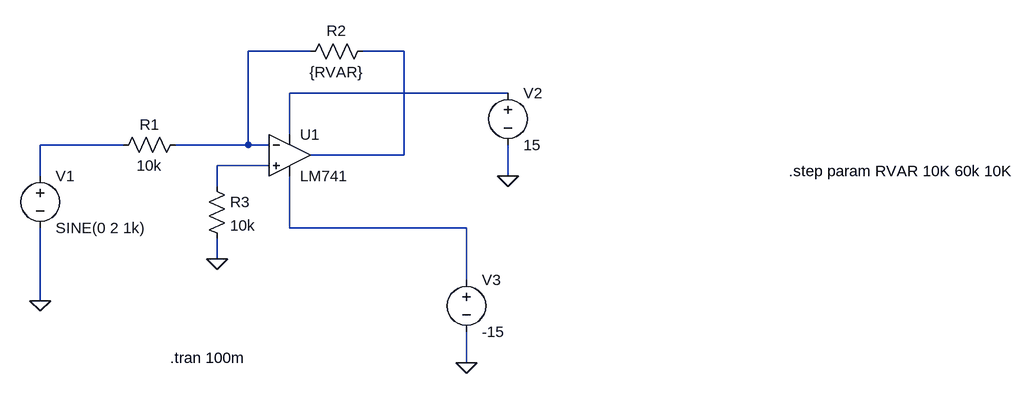
[diagram p0: schematic eviren_kuvvetlendirici_pot_lm741.asc]
eviren_kuvvetlendirici_pot_lm741.asc, the LTspice schematic file:
Version 4
SHEET 1 1424 680
WIRE 288 16 192 16
WIRE 432 16 368 16
WIRE 592 80 256 80
WIRE 256 144 256 80
WIRE 0 160 -128 160
WIRE 192 160 192 16
WIRE 192 160 80 160
WIRE 224 160 192 160
WIRE 432 176 432 16
WIRE 432 176 288 176
WIRE 224 192 144 192
WIRE -128 208 -128 160
WIRE 592 208 592 160
WIRE 144 224 144 192
WIRE 256 288 256 208
WIRE 528 288 256 288
WIRE 144 336 144 304
WIRE 528 368 528 288
WIRE -128 400 -128 288
WIRE 528 496 528 448
FLAG -128 400 0
FLAG 144 336 0
FLAG 592 208 0
FLAG 528 496 0
SYMBOL OpAmps\\LM741 256 112 R0
SYMATTR InstName U1
SYMBOL res 96 144 R90
WINDOW 0 0 56 VBottom 2
WINDOW 3 32 56 VTop 2
SYMATTR InstName R1
SYMATTR Value 10k
SYMBOL res 384 0 R90
WINDOW 0 0 56 VBottom 2
WINDOW 3 32 56 VTop 2
SYMATTR InstName R2
SYMATTR Value {RVAR}
SYMBOL voltage -128 192 R0
WINDOW 123 0 0 Left 0
WINDOW 39 0 0 Left 0
SYMATTR InstName V1
SYMATTR Value SINE(0 2 1k)
SYMBOL res 128 208 R0
SYMATTR InstName R3
SYMATTR Value 10k
SYMBOL voltage 592 64 R0
WINDOW 123 0 0 Left 0
WINDOW 39 0 0 Left 0
SYMATTR InstName V2
SYMATTR Value 15
SYMBOL voltage 528 352 R0
WINDOW 123 0 0 Left 0
WINDOW 39 0 0 Left 0
SYMATTR InstName V3
SYMATTR Value -15
TEXT 72 488 Left 2 !.tran 100m
TEXT 1024 200 Left 2 !.step param RVAR 10K 60k 10K

The netlist it stands for:
* eviren_kuvvetlendirici_pot_lm741.asc
XU1 N005 N001 N003 N006 N002 LM741  ; pins In+ In- V+ V- OUT
R1 N001 N004 10k
R2 N002 N001 {RVAR}
V1 N004 0 SINE(0 2 1k)
R3 N005 0 10k
V2 N003 0 15
V3 N006 0 -15
.tran 100m
.step param RVAR 10K 60k 10K
.lib LM741.lib
.backanno
.end